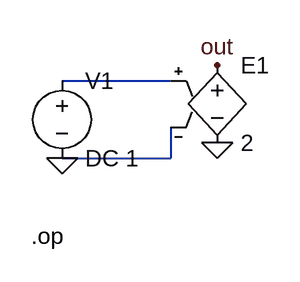
[diagram p0: schematic ltspice_vcvs.asc]
ltspice_vcvs.asc, the LTspice schematic file:
Version 4
SHEET 1 880 680
WIRE 0 64 112 64
WIRE 0 144 112 144
WIRE 112 112 112 144
FLAG 0 144 0
FLAG 160 48 out
FLAG 160 128 0
SYMBOL voltage 0 48 R0
SYMATTR InstName V1
SYMATTR Value DC 1
SYMBOL e 160 32 R0
SYMATTR InstName E1
SYMATTR Value 2
TEXT -32 224 Left 2 !.op

The netlist it stands for:
* ltspice_vcvs.asc
V1 N001 0 DC 1
E1 out 0 N001 0 2
.op
.backanno
.end